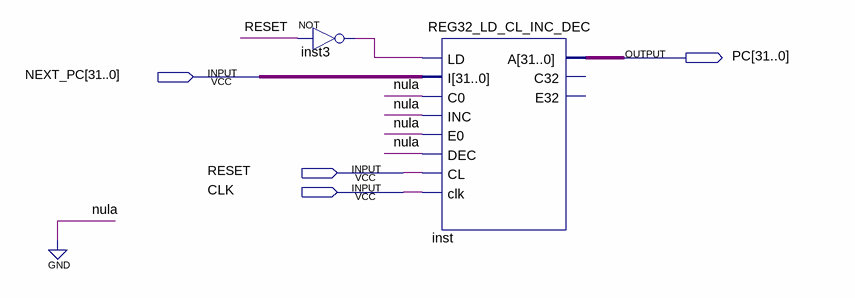
[diagram p0: schematic sheet]
// Quartus schematic pc.bdf as structural Verilog: 2 symbols, 4 pins
module pc (
  input  [31:0] NEXT_PC,
  input  RESET,
  input  CLK,
  output [31:0] PC
);

  wire inst3_out;

  not inst3 (inst3_out, RESET);
  REG32_LD_CL_INC_DEC inst (
    .LD(inst3_out), .I(NEXT_PC), .C0(1'b0), .INC(1'b0), .E0(1'b0), .DEC(1'b0), .CL(RESET), .clk(CLK), .A(PC));  // open: C32, E32
endmodule
